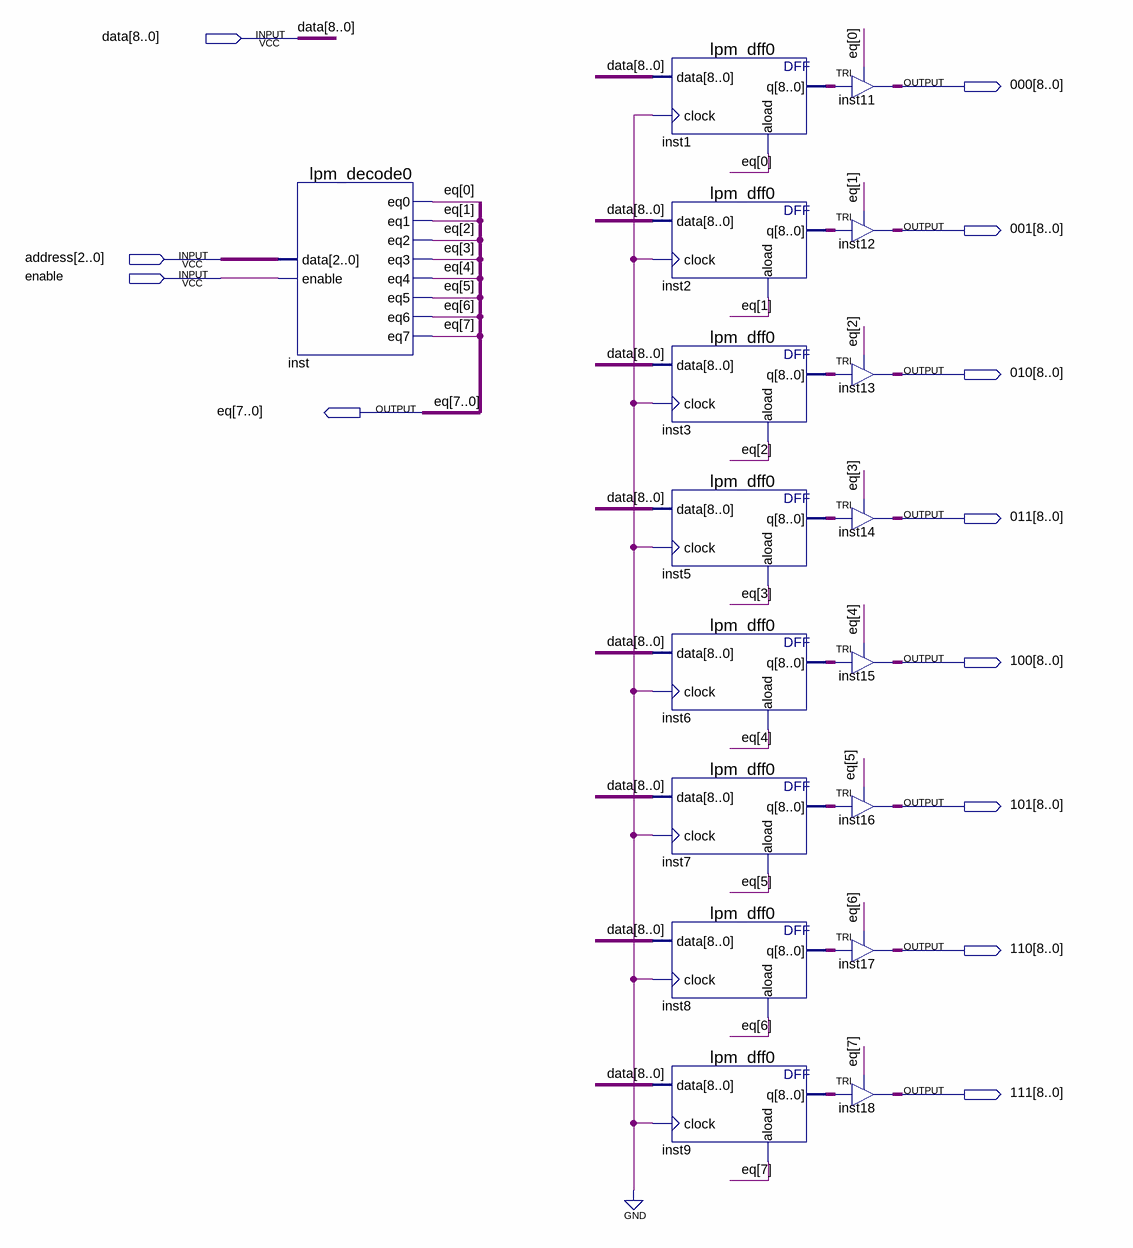
[diagram p0: schematic sheet]
// Quartus schematic regs.bdf as structural Verilog: 17 symbols, 12 pins
module regs (
  input  [8:0] data,
  input  [2:0] address,
  input  enable,
  output [8:0] \000 ,
  output [8:0] \001 ,
  output [8:0] \010 ,
  output [7:0] eq,
  output [8:0] \011 ,
  output [8:0] \100 ,
  output [8:0] \101 ,
  output [8:0] \110 ,
  output [8:0] \111 
);

  wire [8:0] inst1_q, inst2_q, inst3_q, inst5_q, inst6_q, inst7_q, inst8_q, inst9_q;

  lpm_decode0 inst (
    .data(address), .enable(enable), .eq0(eq[0]), .eq1(eq[1]), .eq2(eq[2]), .eq3(eq[3]), .eq4(eq[4]),
    .eq5(eq[5]), .eq6(eq[6]), .eq7(eq[7]));
  lpm_dff0 inst1 (.data(data), .clock(1'b0), .aload(eq[0]), .q(inst1_q));
  lpm_dff0 inst2 (.data(data), .clock(1'b0), .aload(eq[1]), .q(inst2_q));
  lpm_dff0 inst3 (.data(data), .clock(1'b0), .aload(eq[2]), .q(inst3_q));
  lpm_dff0 inst5 (.data(data), .clock(1'b0), .aload(eq[3]), .q(inst5_q));
  lpm_dff0 inst6 (.data(data), .clock(1'b0), .aload(eq[4]), .q(inst6_q));
  lpm_dff0 inst7 (.data(data), .clock(1'b0), .aload(eq[5]), .q(inst7_q));
  lpm_dff0 inst8 (.data(data), .clock(1'b0), .aload(eq[6]), .q(inst8_q));
  lpm_dff0 inst9 (.data(data), .clock(1'b0), .aload(eq[7]), .q(inst9_q));
  TRI inst11[8:0] (.IN(inst1_q), .OE(eq[0]), .OUT(\000 ));
  TRI inst12[8:0] (.IN(inst2_q), .OE(eq[1]), .OUT(\001 ));
  TRI inst13[8:0] (.IN(inst3_q), .OE(eq[2]), .OUT(\010 ));
  TRI inst14[8:0] (.IN(inst5_q), .OE(eq[3]), .OUT(\011 ));
  TRI inst15[8:0] (.IN(inst6_q), .OE(eq[4]), .OUT(\100 ));
  TRI inst16[8:0] (.IN(inst7_q), .OE(eq[5]), .OUT(\101 ));
  TRI inst17[8:0] (.IN(inst8_q), .OE(eq[6]), .OUT(\110 ));
  TRI inst18[8:0] (.IN(inst9_q), .OE(eq[7]), .OUT(\111 ));
endmodule
